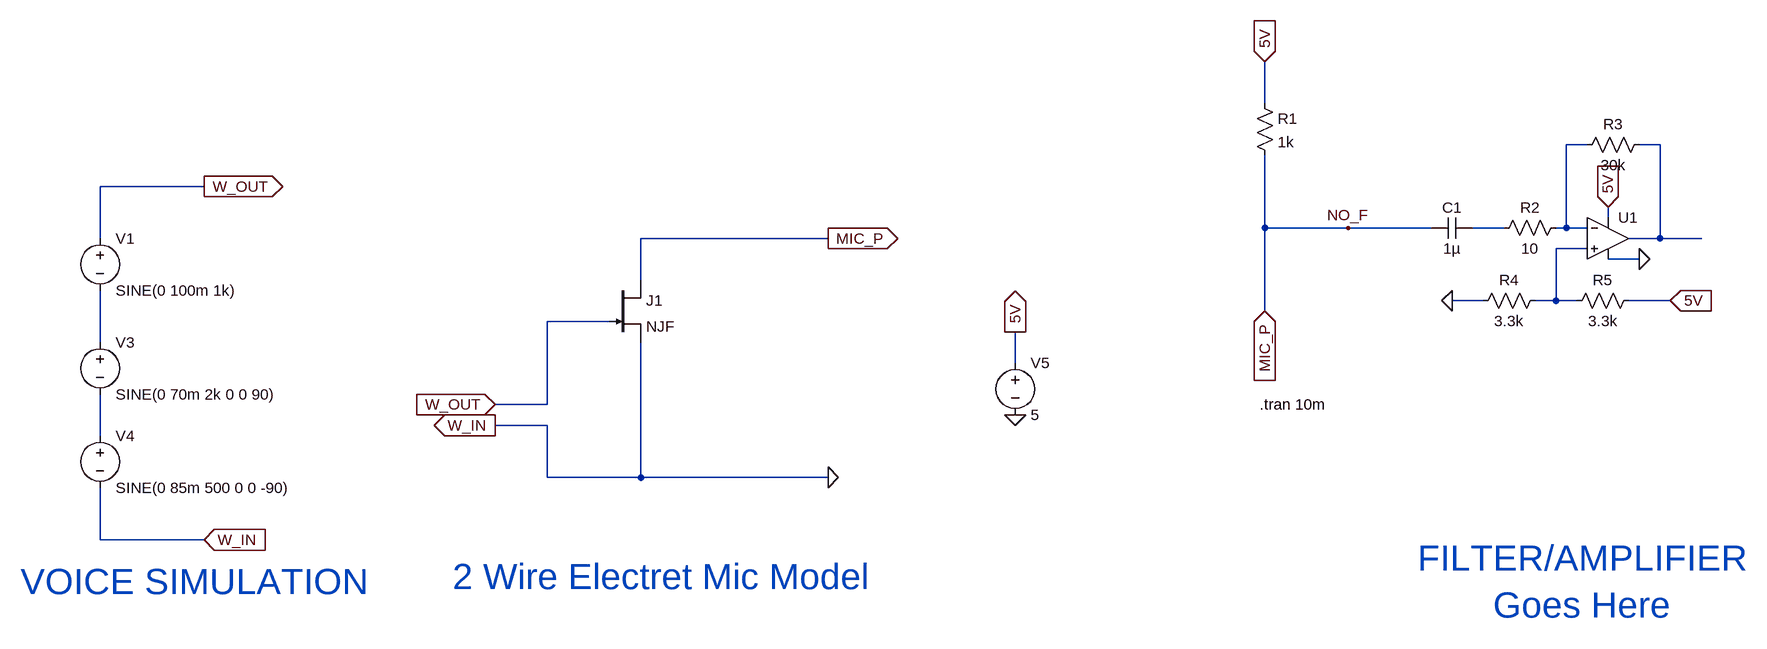
[diagram p0: schematic electret_mic_amplified.asc]
electret_mic_amplified.asc, the LTspice schematic file:
Version 4
SHEET 1 1836 680
WIRE 320 -208 320 -272
WIRE 816 -144 784 -144
WIRE 928 -144 896 -144
WIRE -1312 -80 -1472 -80
WIRE 848 -32 848 -48
WIRE 320 -16 320 -128
WIRE 448 -16 320 -16
WIRE 576 -16 448 -16
WIRE 688 -16 640 -16
WIRE 784 -16 784 -144
WIRE 784 -16 768 -16
WIRE 816 -16 784 -16
WIRE -1472 0 -1472 -80
WIRE -352 0 -640 0
WIRE 928 0 928 -144
WIRE 928 0 880 0
WIRE 992 0 928 0
WIRE 816 16 768 16
WIRE 896 32 848 32
WIRE -640 64 -640 0
WIRE 656 96 608 96
WIRE 768 96 768 16
WIRE 768 96 736 96
WIRE 800 96 768 96
WIRE 944 96 880 96
WIRE 320 112 320 -16
WIRE -688 128 -784 128
WIRE -1472 160 -1472 80
WIRE -64 192 -64 144
WIRE -784 256 -784 128
WIRE -784 256 -864 256
WIRE -784 288 -864 288
WIRE -1472 304 -1472 240
WIRE -784 368 -784 288
WIRE -640 368 -640 160
WIRE -640 368 -784 368
WIRE -352 368 -640 368
WIRE -1472 464 -1472 384
WIRE -1312 464 -1472 464
FLAG -352 368 0
FLAG 320 -272 5V
IOPIN 320 -272 In
FLAG -352 0 MIC_P
IOPIN -352 0 Out
FLAG 320 112 MIC_P
IOPIN 320 112 In
FLAG -1312 464 W_IN
IOPIN -1312 464 In
FLAG -1312 -80 W_OUT
IOPIN -1312 -80 Out
FLAG -864 256 W_OUT
IOPIN -864 256 In
FLAG -864 288 W_IN
IOPIN -864 288 Out
FLAG -64 272 0
FLAG -64 144 5V
IOPIN -64 144 Out
FLAG 448 -16 NO_F
FLAG 608 96 0
FLAG 944 96 5V
IOPIN 944 96 In
FLAG 896 32 0
FLAG 848 -48 5V
IOPIN 848 -48 In
SYMBOL voltage -1472 -16 R0
WINDOW 123 0 0 Left 0
WINDOW 39 0 0 Left 0
SYMATTR InstName V1
SYMATTR Value SINE(0 100m 1k)
SYMBOL njf -688 64 R0
SYMATTR InstName J1
SYMBOL res 304 -224 R0
SYMATTR InstName R1
SYMATTR Value 1k
SYMBOL voltage -1472 144 R0
WINDOW 123 0 0 Left 0
WINDOW 39 0 0 Left 0
SYMATTR InstName V3
SYMATTR Value SINE(0 70m 2k 0 0 90)
SYMBOL voltage -1472 288 R0
WINDOW 123 0 0 Left 0
WINDOW 39 0 0 Left 0
SYMATTR InstName V4
SYMATTR Value SINE(0 85m 500 0 0 -90)
SYMBOL voltage -64 176 R0
WINDOW 123 0 0 Left 0
WINDOW 39 0 0 Left 0
SYMATTR InstName V5
SYMATTR Value 5
SYMBOL cap 640 -32 R90
WINDOW 0 0 32 VBottom 2
WINDOW 3 32 32 VTop 2
SYMATTR InstName C1
SYMATTR Value 1µ
SYMBOL OpAmps\\UniversalOpAmp 848 0 R0
SYMATTR InstName U1
SYMBOL res 784 -32 R90
WINDOW 0 0 56 VBottom 2
WINDOW 3 32 56 VTop 2
SYMATTR InstName R2
SYMATTR Value 10
SYMBOL res 912 -160 R90
WINDOW 0 0 56 VBottom 2
WINDOW 3 32 56 VTop 2
SYMATTR InstName R3
SYMATTR Value 30k
SYMBOL res 752 80 R90
WINDOW 0 0 56 VBottom 2
WINDOW 3 32 56 VTop 2
SYMATTR InstName R4
SYMATTR Value 3.3k
SYMBOL res 896 80 R90
WINDOW 0 0 56 VBottom 2
WINDOW 3 32 56 VTop 2
SYMATTR InstName R5
SYMATTR Value 3.3k
TEXT -608 520 Center 5 ;2 Wire Electret Mic Model
TEXT -1328 528 Center 5 ;VOICE SIMULATION
TEXT 808 528 Center 5 ;FILTER/AMPLIFIER\nGoes Here
TEXT 312 256 Left 2 !.tran 10m

The netlist it stands for:
* electret_mic_amplified.asc
V1 W_OUT N005 SINE(0 100m 1k)
J1 NO_F W_OUT 0 NJF
R1 5V NO_F 1k
V3 N005 N006 SINE(0 70m 2k 0 0 90)
V4 N006 0 SINE(0 85m 500 0 0 -90)
V5 5V 0 5
C1 N003 NO_F 1µ
XU1 N004 N001 5V 0 N002 level1 Avol=1Meg GBW=10Meg Vos=0 En=0 Enk=0 In=0 Ink=0 Rin=500Meg  ; pins In+ In- V+ V- OUT
R2 N001 N003 10
R3 N002 N001 30k
R4 N004 0 3.3k
R5 5V N004 3.3k
.model NJF NJF
.model PJF PJF
.lib standard.jft
* 2 Wire Electret Mic Model
* VOICE SIMULATION
* FILTER/AMPLIFIER
* Goes Here
.tran 10m
.lib UniversalOpAmp1.lib
.backanno
.end